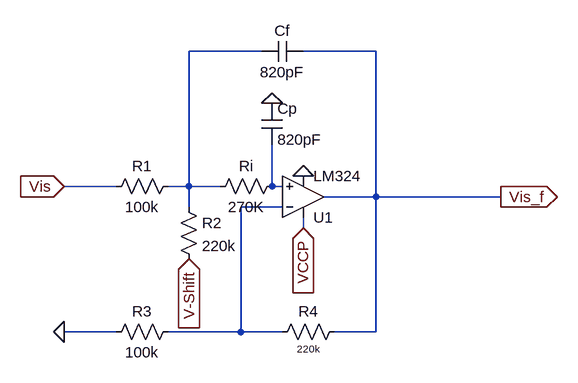
[diagram p0: schematic sig_cond_2ord_shunt.asc]
sig_cond_2ord_shunt.asc, the LTspice schematic file:
Version 4.1
SHEET 1 880 680
WIRE 16 -112 -96 -112
WIRE 192 -112 80 -112
WIRE -208 96 -288 96
WIRE -96 96 -96 -112
WIRE -96 96 -128 96
WIRE -48 96 -96 96
WIRE 32 96 32 32
WIRE 48 96 32 96
WIRE 192 112 192 -112
WIRE 192 112 112 112
WIRE 384 112 192 112
WIRE -96 128 -96 96
WIRE 48 128 -16 128
WIRE 80 160 80 144
WIRE -208 320 -288 320
WIRE -16 320 -16 128
WIRE -16 320 -128 320
WIRE 48 320 -16 320
WIRE 192 320 192 112
WIRE 192 320 128 320
FLAG -96 208 V-Shift
IOPIN -96 208 In
FLAG -288 96 Vis
IOPIN -288 96 In
FLAG -288 320 0
FLAG 80 160 VCCP
IOPIN 80 160 In
FLAG 384 112 Vis_f
IOPIN 384 112 Out
FLAG 80 80 0
FLAG 32 -32 0
SYMBOL OpAmps\\opamp2 80 176 M180
SYMATTR InstName U1
SYMATTR Value LM324
SYMBOL res -112 112 R0
SYMATTR InstName R2
SYMATTR Value 220k
SYMBOL res -112 80 R90
WINDOW 0 0 56 VBottom 2
WINDOW 3 32 56 VTop 2
SYMATTR InstName R1
SYMATTR Value 100k
SYMBOL res -112 304 R90
WINDOW 0 0 56 VBottom 2
WINDOW 3 32 56 VTop 2
SYMATTR InstName R3
SYMATTR Value 100k
SYMBOL res 144 304 R90
WINDOW 0 0 56 VBottom 2
WINDOW 3 32 56 VTop 1
SYMATTR InstName R4
SYMATTR Value 220k
SYMBOL cap 16 -32 R0
SYMATTR InstName Cp
SYMATTR Value 820pF
SYMBOL cap 80 -128 R90
WINDOW 0 0 32 VBottom 2
WINDOW 3 32 32 VTop 2
SYMATTR InstName Cf
SYMATTR Value 820pF
SYMBOL res 48 80 R90
WINDOW 0 0 56 VBottom 2
WINDOW 3 32 56 VTop 2
SYMATTR InstName Ri
SYMATTR Value 270K

The netlist it stands for:
* sig_cond_2ord_shunt.asc
X§U1 N002 N003 VCCP 0 Vis_f LM324  ; pins In+ In- V+ V- OUT
R2 N001 V-Shift 220k
R1 N001 Vis 100k
R3 N003 0 100k
R4 Vis_f N003 220k
Cp 0 N002 820pF
Cf Vis_f N001 820pF
Ri N002 N001 270K
.backanno
.end